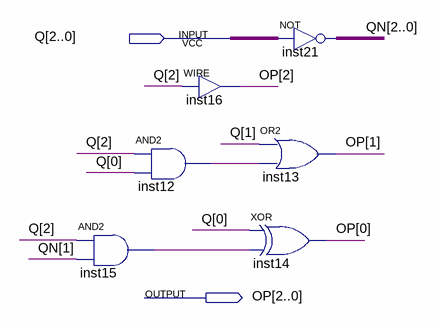
[diagram p0: schematic sheet]
// Quartus schematic OPCODE.bdf as structural Verilog: 6 symbols, 2 pins
module OPCODE (
  input  [2:0] Q,
  output [2:0] OP
);

  wire inst12_out, inst15_out;
  wire [2:0] QN;

  and inst15 (inst15_out, Q[2], QN[1]);
  and inst12 (inst12_out, Q[2], Q[0]);
  assign OP[2] = Q[2];  // WIRE inst16
  xor inst14 (OP[0], Q[0], inst15_out);
  assign QN = ~Q;  // NOT inst21, 3 bits wide
  or inst13 (OP[1], Q[1], inst12_out);
endmodule
